# Altium schematic sheet TMS320VC5509AMINI.SchDoc
size 332 x 243 mm
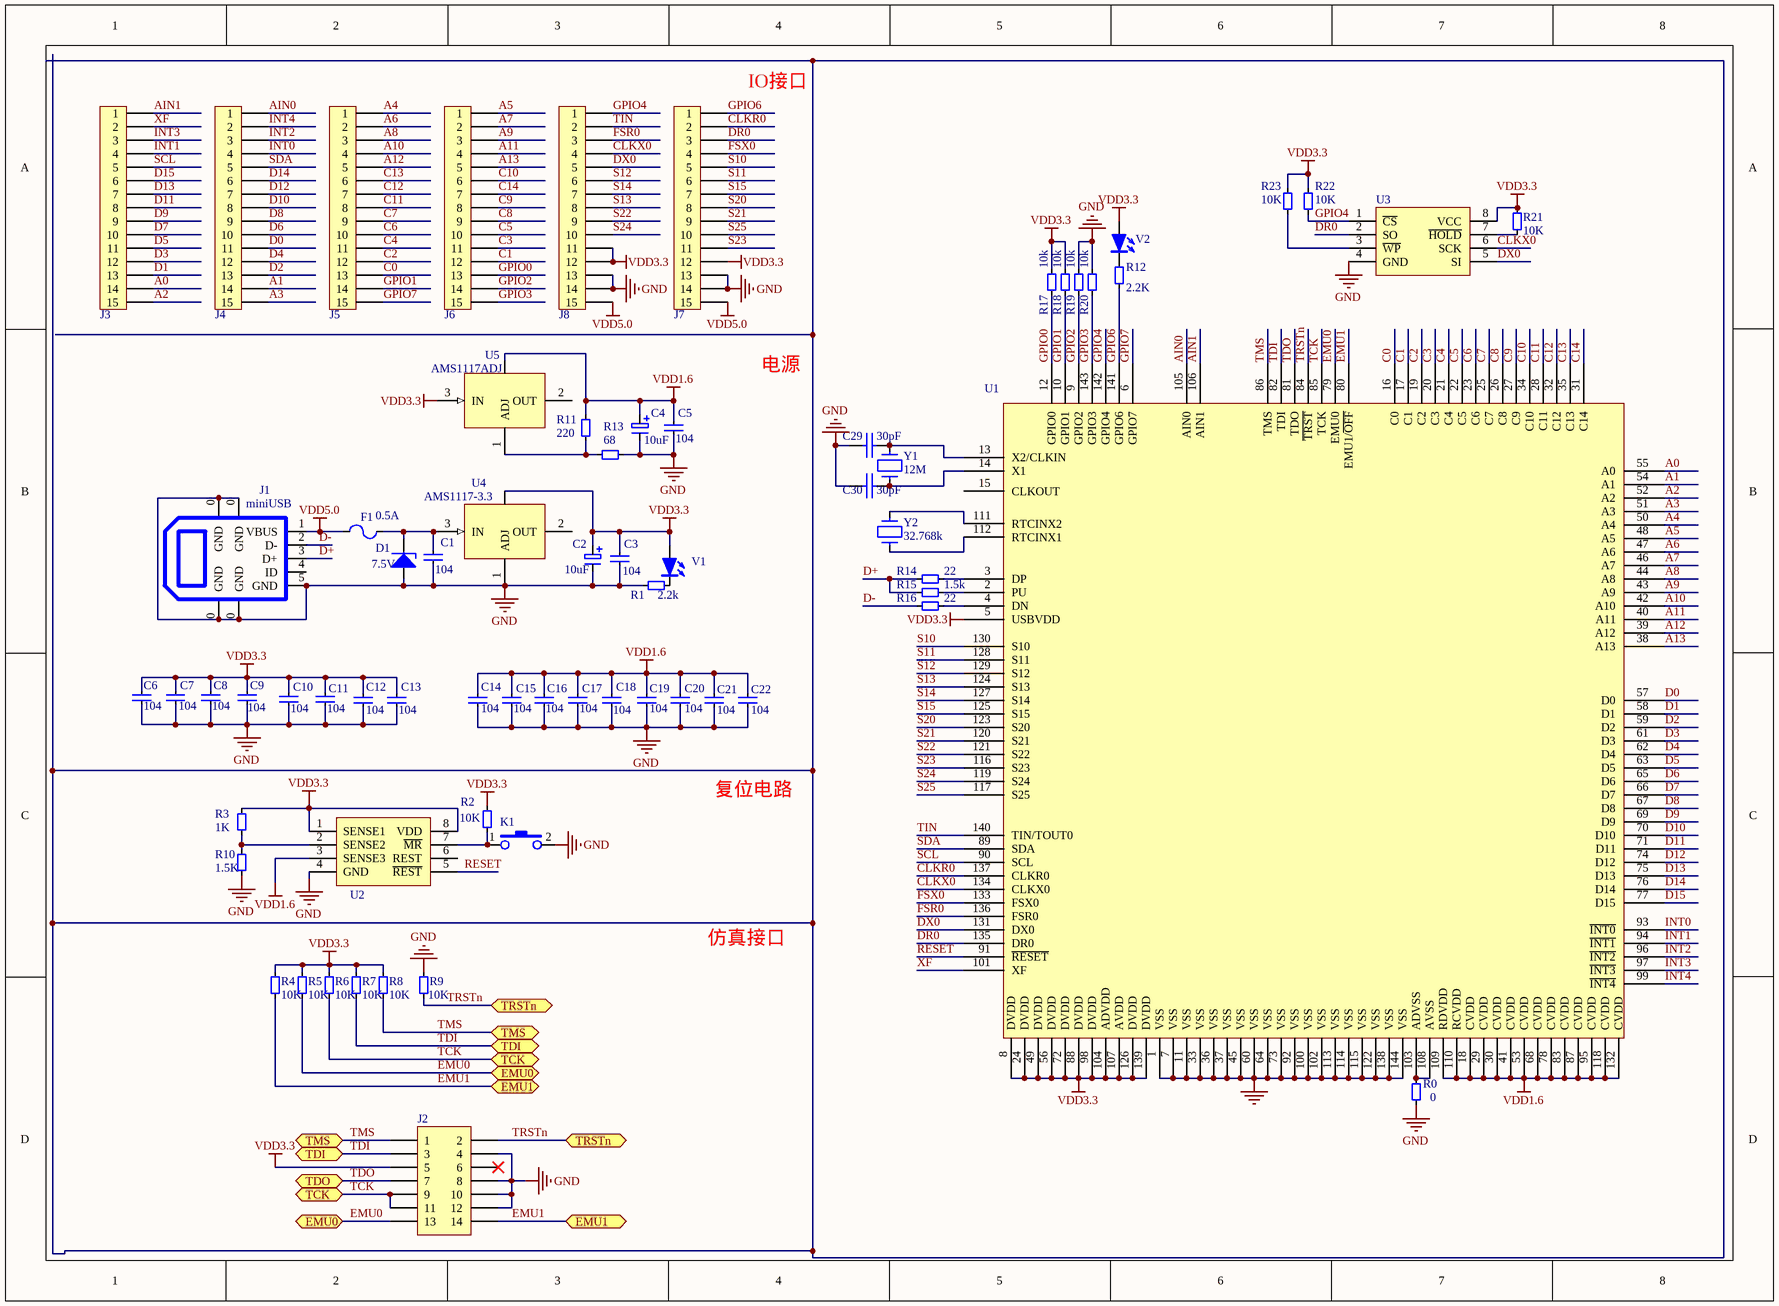
[diagram p0: TMS320VC5509AMINI.SchDoc]

## Parts
C1  104  [0805_C_M]
C2  10uF  [CAP-B]
C3  104  [0805_C_M]
C4  10uF  [CAP-B]
C5  104  [0805_C_M]
C6  104  [0805_C_M]
C7  104  [0805_C_M]
C8  104  [0805_C_M]
C9  104  [0805_C_M]
C10  104  [0805_C_M]
C11  104  [0805_C_M]
C12  104  [0805_C_M]
C13  104  [0805_C_M]
C14  104  [0805_C_M]
C15  104  [0805_C_M]
C16  104  [0805_C_M]
C17  104  [0805_C_M]
C18  104  [0805_C_M]
C19  104  [0805_C_M]
C20  104  [0805_C_M]
C21  104  [0805_C_M]
C22  104  [0805_C_M]
C29  30pF  [0805_C_M]
C30  30pF  [0805_C_M]
D1  7.5V  [1206D]
F1  0.5A  [1812F]
J1  miniUSB  [MINIUSB-S]
J2  Header 7X2  [JTAG14]  (value not drawn)
J3  SIP15  [SIP15_2.54]  (value not drawn)
J4  SIP15  [SIP15_2.54]  (value not drawn)
J5  SIP15  [SIP15_2.54]  (value not drawn)
J6  SIP15  [SIP15_2.54]  (value not drawn)
J7  SIP15  [SIP15_2.54]  (value not drawn)
J8  SIP15  [SIP15_2.54]  (value not drawn)
K1  KEY1  [KEY2]  (value not drawn)
R0  0  [0805_R_M]
R1  2.2k  [0805_R_M]
R2  10K  [0805_R_M]
R3  1K  [0805_R_M]
R4  10K  [0805_R_M]
R5  10K  [0805_R_M]
R6  10K  [0805_R_M]
R7  10K  [0805_R_M]
R8  10K  [0805_R_M]
R9  10K  [0805_R_M]
R10  1.5K  [0805_R_M]
R11  220  [0805_R_M]
R12  2.2K  [0805_R_M]
R13  68  [0805_R_M]
R14  22  [0805_R_M]
R15  1.5k  [0805_R_M]
R16  22  [0805_R_M]
R17  10k  [0805_R_M]
R18  10k  [0805_R_M]
R19  10k  [0805_R_M]
R20  10k  [0805_R_M]
R21  10K  [0805_R_M]
R22  10K  [0805_R_M]
R23  10K  [0805_R_M]
U1  TMS320VC5509A  [TMS320C5509APGE]  (value not drawn)
U2  TPS3307-18  [SOP8]  (value not drawn)
U3  AT25256  [SOP8]  (value not drawn)
U4  AMS1117-3.3  [LM1117]
U5  AMS1117ADJ  [LM1117]
V1  LED  [0805D]  (value not drawn)
V2  LED  [0805D]  (value not drawn)
Y1  12M  [5032]
Y2  32.768k  [DT-26]

## Ports
EMU0 (bidir), EMU1 (bidir), TCK (bidir), TDI (bidir), TDO, TMS (bidir), TRSTn (bidir)

## Nets
GND: C1.2 C2.2 C3.2 C4.2 C5.2 C6.2 C7.2 C8.2 C9.2 C10.2 C11.2 C12.2 C13.2 C14.2 C15.2 C16.2 C17.2 C18.2 C19.2 C20.2 C21.1 C22.1 C29.1 C30.1 D1.1 J1.0(GND) J1.5(GND) J2.4 J2.8 J2.10 J2.12 J7.13 J7.14 J8.13 J8.14 K1.2 R0.1 R1.2 R9.2 R10.2 R13.2 R19.1 R20.1 U1.1(VSS) U1.7(VSS) U1.11(VSS) U1.33(VSS) U1.36(VSS) U1.37(VSS) U1.45(VSS) U1.60(VSS) U1.64(VSS) U1.73(VSS) U1.92(VSS) U1.100(VSS) U1.102(VSS) U1.113(VSS) U1.114(VSS) U1.115(VSS) U1.122(VSS) U1.138(VSS) U1.144(VSS) U2.4(GND) U3.4(GND) U4.1(ADJ)
VDD1.6: C4.1 C5.1 C14.1 C15.1 C16.1 C17.1 C18.1 C19.1 C20.1 C21.2 C22.2 R11.1 U1.18(CVDD) U1.29(CVDD) U1.30(CVDD) U1.41(CVDD) U1.53(CVDD) U1.68(CVDD) U1.78(CVDD) U1.83(CVDD) U1.87(CVDD) U1.95(CVDD) U1.109(RDVDD) U1.110(RCVDD) U1.118(CVDD) U1.132(CVDD) U2.3(SENSE3) U5.4
VDD3.3: C2.1 C3.1 C6.1 C7.1 C8.1 C9.1 C10.1 C11.1 C12.1 C13.1 J2.5 J7.12 J8.11 J8.12 R2.1 R3.2 R4.2 R5.2 R6.2 R7.2 R8.2 R17.1 R18.1 R21.1 R22.2 R23.1 U1.5(USBVDD) U1.8(DVDD) U1.24(DVDD) U1.49(DVDD) U1.56(DVDD) U1.72(DVDD) U1.88(DVDD) U1.98(DVDD) U1.104(ADVDD) U1.107(AVDD) U1.126(DVDD) U1.139(DVDD) U2.1(SENSE1) U2.8(VDD) U3.8(VCC) U4.4 U5.3(IN) V1.1 V2.1
VDD5.0: F1.1 J1.1(VBUS) J7.15 J8.15
A0: J3.14 U1.55(A0)
A1: J4.14 U1.54(A1)
A2: J3.15 U1.52(A2)
A3: J4.15 U1.51(A3)
A4: J5.1 U1.50(A4)
A5: J6.1 U1.48(A5)
A6: J5.2 U1.47(A6)
A7: J6.2 U1.46(A7)
A8: J5.3 U1.44(A8)
A9: J6.3 U1.43(A9)
A10: J5.4 U1.42(A10)
A11: J6.4 U1.40(A11)
A12: J5.5 U1.39(A12)
A13: J6.5 U1.38(A13)
AIN0: J4.1 U1.105(AIN0)
AIN1: J3.1 U1.106(AIN1)
C0: J5.13 U1.16(C0)
C1: J6.12 U1.17(C1)
C2: J5.12 U1.19(C2)
C3: J6.11 U1.20(C3)
C4: J5.11 U1.21(C4)
C5: J6.10 U1.22(C5)
C6: J5.10 U1.23(C6)
C7: J5.9 U1.25(C7)
C8: J6.9 U1.26(C8)
C9: J6.8 U1.27(C9)
C10: J6.6 U1.34(C10)
C11: J5.8 U1.28(C11)
C12: J5.7 U1.32(C12)
C13: J5.6 U1.35(C13)
C14: J6.7 U1.31(C14)
CLKR0: J7.2 U1.137(CLKR0)
CLKX0: J8.4 U1.134(CLKX0) U3.6(SCK)
D0: J4.11 U1.57(D0)
D1: J3.13 U1.58(D1)
D2: J4.13 U1.59(D2)
D3: J3.12 U1.61(D3)
D4: J4.12 U1.62(D4)
D5: J3.11 U1.63(D5)
D6: J4.10 U1.65(D6)
D7: J3.10 U1.66(D7)
D8: J4.9 U1.67(D8)
D9: J3.9 U1.69(D9)
D10: J4.8 U1.70(D10)
D11: J3.8 U1.71(D11)
D12: J4.7 U1.74(D12)
D13: J3.7 U1.75(D13)
D14: J4.6 U1.76(D14)
D15: J3.6 U1.77(D15)
D+: J1.3(D+) R14.2 R15.2
D-: J1.2(D-) R16.2
DR0: J7.3 U1.135(DR0) U3.2(SO)
DX0: J8.5 U1.131(DX0) U3.5(SI)
EMU0: J2.13 R5.1 U1.79(EMU0) ; port EMU0
EMU1: J2.14 R4.1 U1.80(EMU1/~{OFF}) ; port EMU1
FSR0: J8.3 U1.136(FSR0)
FSX0: J7.4 U1.133(FSX0)
GPIO0: J6.13 R17.2 U1.12(GPIO0)
GPIO1: J5.14 R18.2 U1.10(GPIO1)
GPIO2: J6.14 R19.2 U1.9(GPIO2)
GPIO3: J6.15 R20.2 U1.143(GPIO3)
GPIO4: J8.1 R22.1 U1.142(GPIO4) U3.1(~{CS})
GPIO6: J7.1 R12.2 U1.141(GPIO6)
GPIO7: J5.15 U1.6(GPIO7)
INT0: J4.4 U1.93(~{INT0})
INT1: J3.4 U1.94(~{INT1})
INT2: J4.3 U1.96(~{INT2})
INT3: J3.3 U1.97(~{INT3})
INT4: J4.2 U1.99(~{INT4})
RESET: U1.91(~{RESET}) U2.5(~{REST})
S10: J7.5 U1.130(S10)
S11: J7.6 U1.128(S11)
S12: J8.6 U1.129(S12)
S13: J8.8 U1.124(S13)
S14: J8.7 U1.127(S14)
S15: J7.7 U1.125(S15)
S20: J7.8 U1.123(S20)
S21: J7.9 U1.120(S21)
S22: J8.9 U1.121(S22)
S23: J7.11 U1.116(S23)
S24: J8.10 U1.119(S24)
S25: J7.10 U1.117(S25)
SCL: J3.5 U1.90(SCL)
SDA: J4.5 U1.89(SDA)
TCK: J2.9 J2.11 R6.1 U1.85(TCK) ; port TCK
TDI: J2.3 R7.1 U1.82(TDI) ; port TDI
TDO: J2.7 U1.81(TDO) ; port TDO
TIN: J8.2 U1.140(TIN/TOUT0)
TMS: J2.1 R8.1 U1.86(TMS) ; port TMS
TRSTn: J2.2 R9.1 U1.84(~{TRST}) ; port TRSTn
XF: J3.2 U1.101(XF)
NetC1_1: C1.1 D1.2 F1.2 U4.3(IN)
NetC29_2: C29.2 U1.13(X2/CLKIN) Y1.2
NetC30_2: C30.2 U1.14(X1) Y1.1
NetK1_1: K1.1 R2.2 U2.7(~{MR})
NetR0_2: R0.2 U1.103(ADVSS) U1.108(AVSS)
NetR1_1: R1.1 V1.2
NetR3_1: R3.1 R10.1 U2.2(SENSE2)
NetR11_2: R11.2 R13.1 U5.1(ADJ)
NetR12_1: R12.1 V2.2
NetR14_1: R14.1 U1.3(DP)
NetR15_1: R15.1 U1.2(PU)
NetR16_1: R16.1 U1.4(DN)
NetR21_2: R21.2 U3.7(~{HOLD})
NetR23_2: R23.2 U3.3(~{WP})
NetU1_111: U1.111(RTCINX2) Y2.1
NetU1_112: U1.112(RTCINX1) Y2.2

Not connected (* = marked no-connect by the designer): J1 4(ID); J2 6*; U1 15(CLKOUT); U2 6(REST); U4 2(OUT); U5 2(OUT)

## Notes on the sheet
- (near J7) IO接口
- 电源
- 复位电路
- 仿真接口

## Library data of the parts
C1 C3 C5-C22 = C3
C2 C4 = E3
C29 C30 = C1: 0.1: *; 0.01: *; 0.47: *; 0.22: *; 0.022: *; 2.2n: *; 1n: *
D1 = D4
F1 = FUSE1
J2 = Header 7X2: Header, 7-Pin, Dual row; Revision: 17-Jul-2002: Re-released for DXP Platform.; Publisher: Altium Limited
R0-R23 = R3
U1 = TMS320VC5509A: TMS320VC5509
U3 = AT25XXX
U4 U5 = 1117
V1 V2 = LED2
Y1 Y2 = CY1